# EAGLE design Puzzle I2C Motor Driver v0.92 (EAGLE 6.2)
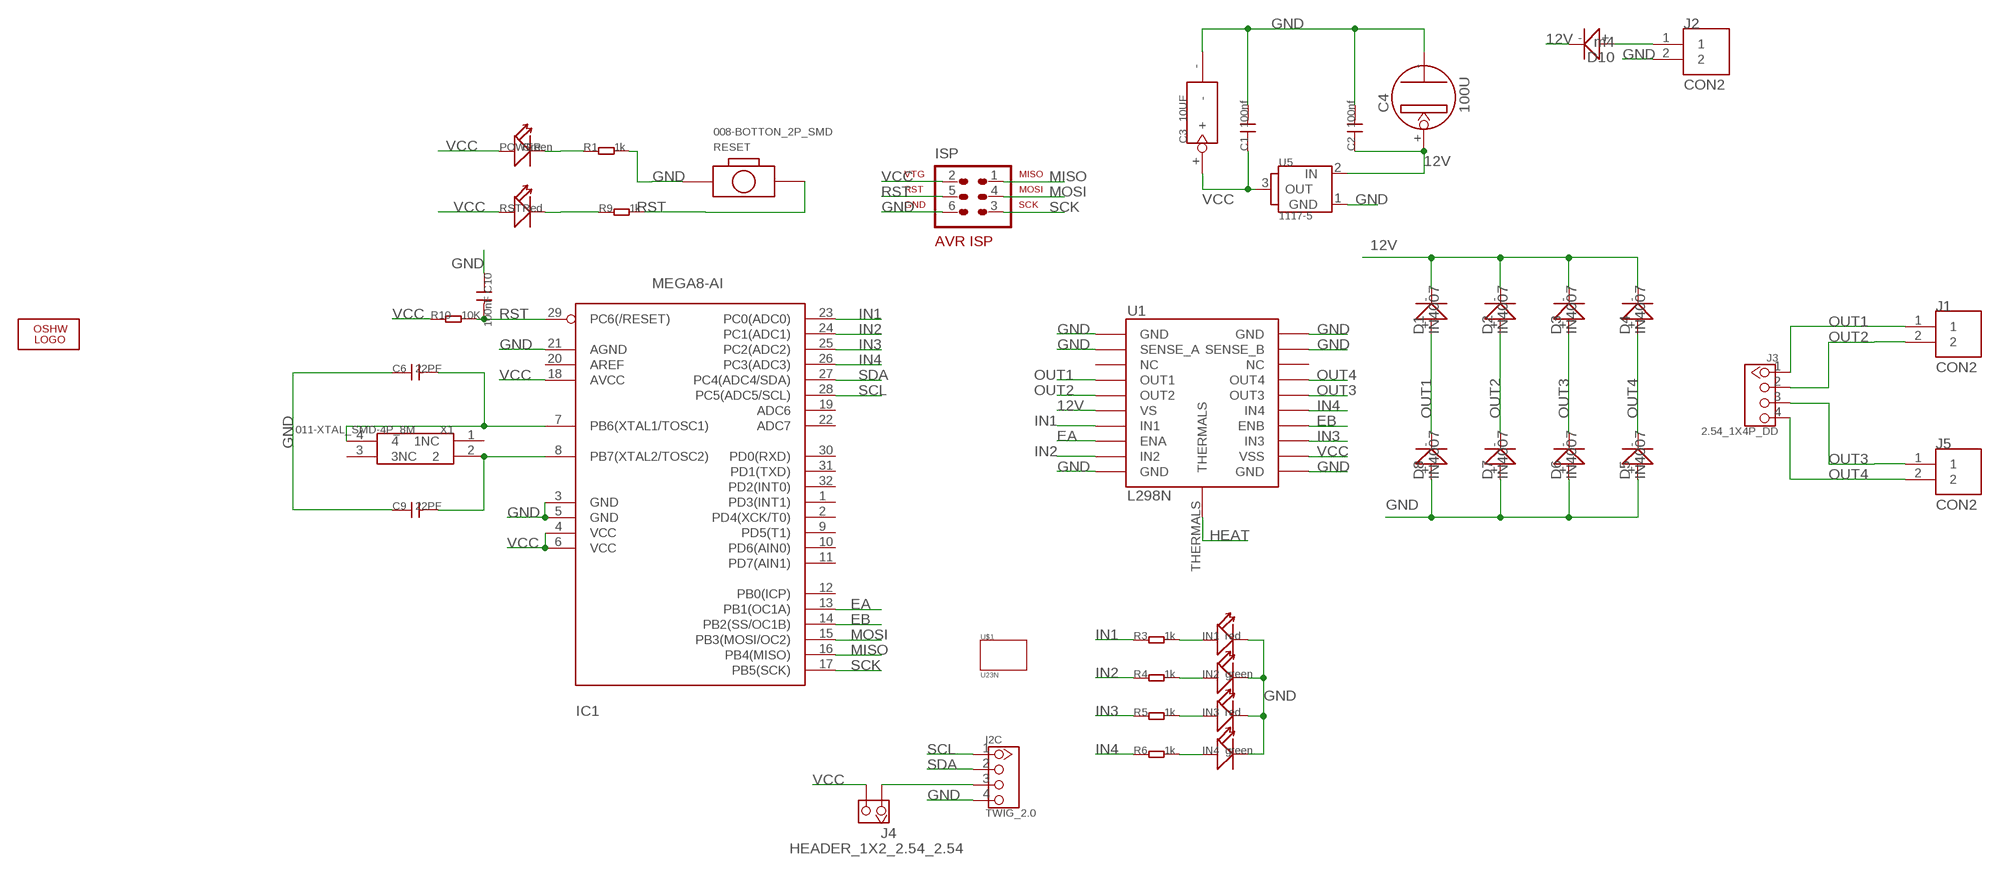
[diagram p0: schematic, sheet 1]

## Parts
C1  100nf  006-C30*35  [0603_S]
C2  100nf  006-C30*35  [0603_S]
C3  10UF  C_TAN_B  [C_TAN_3X3.5]
C4  100U  PANASONIC_D260  [SANYO-OSCON_SMD_C6]
C6  22PF  006-C30*35  [0603_S]
C9  22PF  006-C30*35  [0603_S]
C10  100nF  006-C30*35  [0603_S]
D1  IN4007  010-D2010  [D2010]
D2  IN4007  010-D2010  [D2010]
D3  IN4007  010-D2010  [D2010]
D4  IN4007  010-D2010  [D2010]
D5  IN4007  010-D2010  [D2010]
D6  IN4007  010-D2010  [D2010]
D7  IN4007  010-D2010  [D2010]
D8  IN4007  010-D2010  [D2010]
D10  m4  010-D2010  [D2010]
I2C  TWIG_2.0  [2.0_1X4]
IC1  MEGA8-AI  [TQFP32-08]
IN1  red  007-LED0603  [D0603]
IN2  green  007-LED0603  [D0603]
IN3  red  007-LED0603  [D0603]
IN4  green  007-LED0603  [D0603]
ISP  AVR-ISP-6  [AVR-ISP-6]
J1  CON2  [CON2]
J2  CON2  [CON2]
J3  2.54_1X4P_DD  [CK_1X4]
J4  HEADER_1X2_2.54_2.54  [65*35]
J5  CON2  [CON2]
LOGO2  LOGO-OSHW-FILLX0200-NT  [OSHW_FILLX200_NOTEXT]
POWER  Green  007-LED0603  [D0603]
R1  1k  005-R0603  [0603-1]
R3  1k  005-R0603  [0603-1]
R4  1k  005-R0603  [0603-1]
R5  1k  005-R0603  [0603-1]
R6  1k  005-R0603  [0603-1]
R9  1k  005-R0603  [0603-1]
R10  10K  005-R0603  [0603-1]
RESET  008-BOTTON_2P_SMD  [BOTTON_1]
RST  Red  007-LED0603  [D0603]
U1  L298N  L298_BRIDGE_DRIVER  [POWERSO20]
U5  1117-5  [TO252]
U$1  U23N  [U2*3N]
X1  011-XTAL_SMD-4P_8M  011-XTAL_SMD-4P  [CRYSTAL-SMD-5X3]

## Nets
12V: C2.1 C4.+ D1.- D2.- D3.- D4.- D10.- U1.P$6(VS) U5.2(IN)
EA: IC1.13(PB1(OC1A)) U1.P$8(ENA)
EB: IC1.14(PB2(SS/OC1B)) U1.P$14(ENB)
GND: C1.2 C2.2 C3.- C4.- C6.1 C9.1 C10.1 D5.+ D6.+ D7.+ D8.+ I2C.4 IC1.3(GND) IC1.5(GND) IC1.21(AGND) IN1.- IN2.- IN3.- IN4.- ISP.6 J2.2 R1.2 RESET.1 U1.P$1(GND) U1.P$2(SENSE_A) U1.P$10(GND) U1.P$11(GND) U1.P$19(SENSE_B) U1.P$20(GND) U5.1(GND)
HEAT: U1.THERMALS
IN1: IC1.23(PC0(ADC0)) R3.1 U1.P$7(IN1)
IN2: IC1.24(PC1(ADC1)) R4.1 U1.P$9(IN2)
IN3: IC1.25(PC2(ADC2)) R5.1 U1.P$13(IN3)
IN4: IC1.26(PC3(ADC3)) R6.1 U1.P$15(IN4)
MISO: IC1.16(PB4(MISO)) ISP.1
MOSI: IC1.15(PB3(MOSI/OC2)) ISP.4
N$1: IN3.+ R5.2
N$2: I2C.3 J4.1
N$3: POWER.- R1.1
N$6: D10.+ J2.1
N$8: C6.2 IC1.7(PB6(XTAL1/TOSC1)) X1.4
N$9: C9.2 IC1.8(PB7(XTAL2/TOSC2)) X1.2
N$10: R9.1 RST.-
N$14: IN1.+ R3.2
N$15: IN2.+ R4.2
N$17: IN4.+ R6.2
OUT1: D1.+ D8.- J1.1 J3.1 U1.P$4(OUT1)
OUT2: D2.+ D7.- J1.2 J3.2 U1.P$5(OUT2)
OUT3: D3.+ D6.- J3.3 J5.1 U1.P$16(OUT3)
OUT4: D4.+ D5.- J3.4 J5.2 U1.P$17(OUT4)
RST: C10.2 IC1.29(PC6(/RESET)) ISP.5 R9.2 R10.2 RESET.P$2
SCK: IC1.17(PB5(SCK)) ISP.3
SCL: I2C.1 IC1.28(PC5(ADC5/SCL))
SDA: I2C.2 IC1.27(PC4(ADC4/SDA))
VCC: C1.1 C3.+ IC1.4(VCC) IC1.6(VCC) IC1.18(AVCC) ISP.2 J4.2 POWER.+ R10.1 RST.+ U1.P$12(VSS) U5.3(OUT)
Unconnected: IC1.1(PD3(INT1)) IC1.2(PD4(XCK/T0)) IC1.9(PD5(T1)) IC1.10(PD6(AIN0)) IC1.11(PD7(AIN1)) IC1.12(PB0(ICP)) IC1.19(ADC6) IC1.20(AREF) IC1.22(ADC7) IC1.30(PD0(RXD)) IC1.31(PD1(TXD)) IC1.32(PD2(INT0)) U1.P$3(NC) U1.P$18(NC) X1.1(1NC) X1.3(3NC)

## Library data of the parts
C1 C2 C6 C9 C10 = Discrete:006-C*: Ceramic Capacitors
C3 = CPT_SMD:C_TAN
C4 = CPT_SMD:PANASONIC_D
D1-D8 D10 = Discrete:010-D*
I2C = CONNECTER:TWIG_2.0
IC1 = IC:MEGA8: MICROCONTROLLER 8 Kbytes FLASH 1 kbytes SRAM 512 bytes EEPROM USART 6-channel 10 bit ADC 2-channel 8 bit ADC
IN1-IN4 POWER RST = Discrete:007-LED*
ISP = AVR_Micro_Controllers:AVR-ISP-6: AVR ISP-6 Serial Programming Header
J1 J2 J5 = 2pin:CON2
J3 = Connector:2.54_1X4P
J4 = Connector:HEADER_1X2_2.54
LOGO2 = Logo:LOGO-OSHW-FILL
R1 R3-R6 R9 R10 = Discrete:005-R*
RESET = Discrete:008-BOTTON_2P
U1 = ICs:L298_BRIDGE_DRIVER
U5 = ICs_v54:1117-5
U$1 = twig_template1:U2*3N
X1 = Discrete:011-XTAL_SMD-4P

## Board
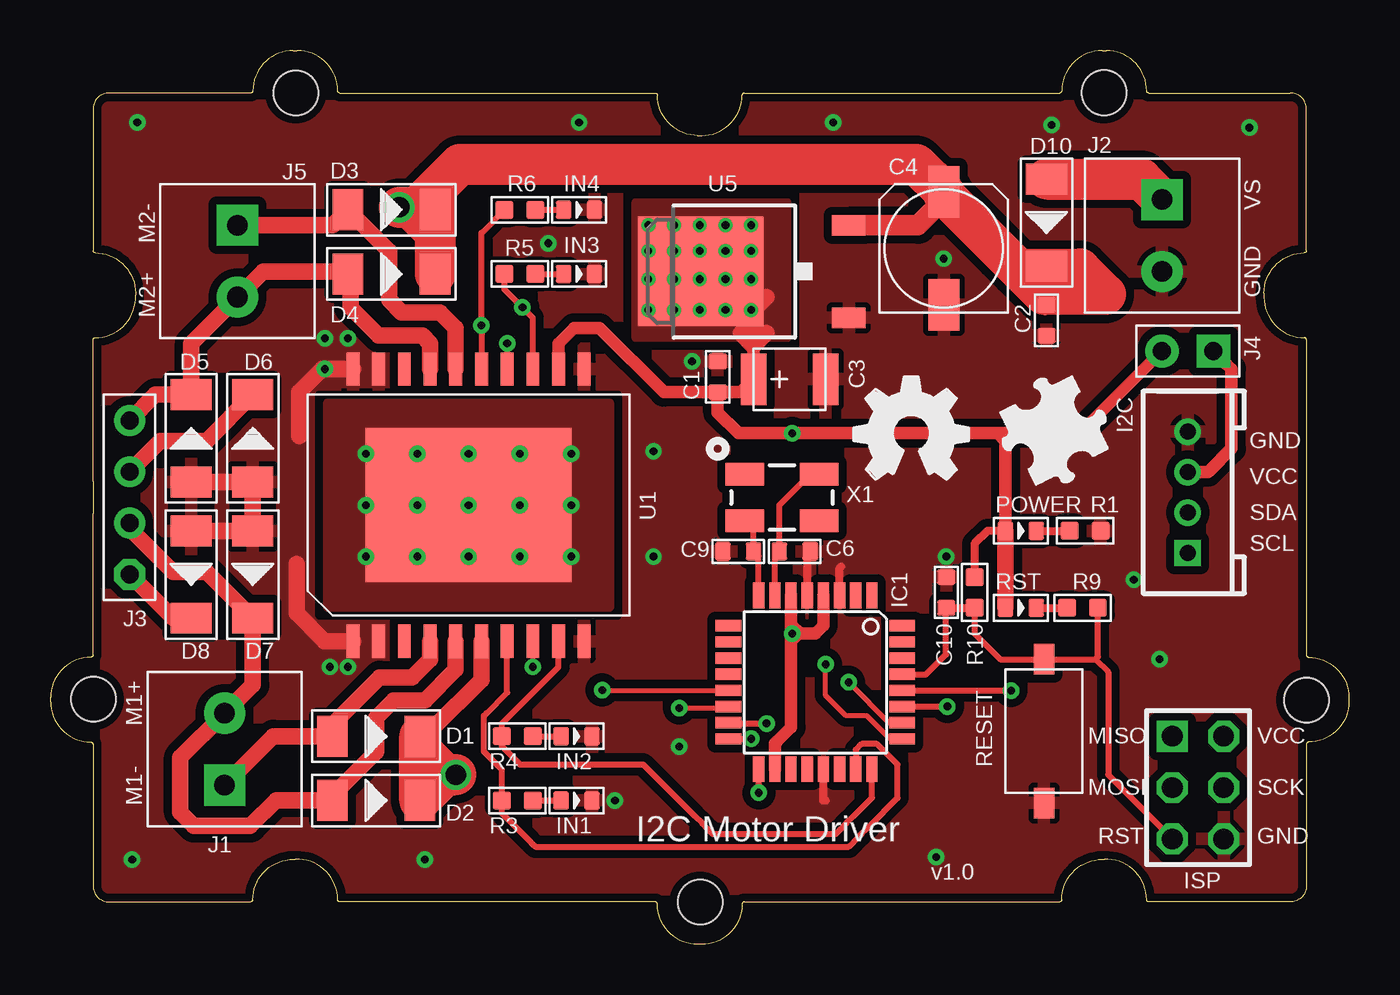
[diagram p1: board, top side]
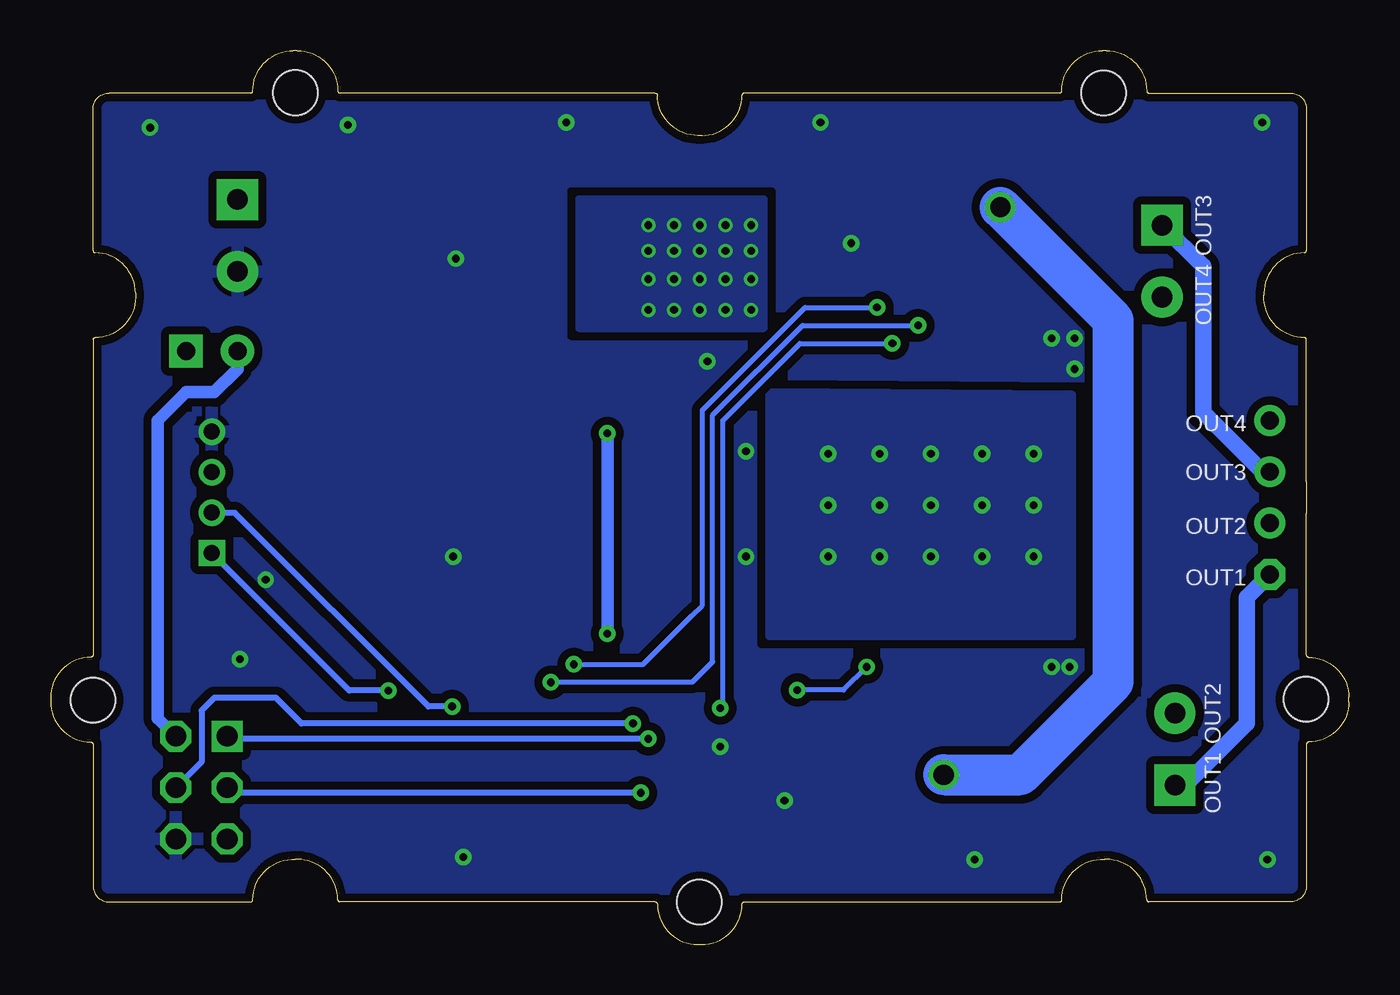
[diagram p2: board, bottom side, seen from below]

Size 64.2 x 44.2 mm. Coordinates in mm from the lower left corner, seen from the top.
Copper layers (1*16): Top 0.035mm / dielectric 1.5mm / Bottom 0.035mm
Design rules: minimum track width 6mil, minimum drill 12mil, track to track 6mil, track to pad 6mil, pad to pad 6mil, via to via 6mil, smd to smd 0mil, copper to edge 10mil, drill to drill 10mil, minimum pad ring 10mil, minimum via ring 6mil, stop-mask expansion 2mil, vias tented up to drill 100mil, thermal gap 10mil

### Footprints (pad centres in the part's own frame; a part is rotated, then mirrored left to right if it is on the bottom)
0603_S = smd 0.762 x 0.889: 1 -0.762,0; 2 0.762,0
C_TAN_3X3.5 = smd 2.54 x 1.27: + 0,1.778; - 0,-1.778
SANYO-OSCON_SMD_C6 = smd 2.54 x 1.524: + 2.794,0; - -2.794,0
D2010 = smd 1.524 x 2.032: + -2.159,0; - 2.159,0
2.0_1X4 = drill 0.8 pad 1.27 square: 1 -3,0 | drill 0.8 pad 1.27: 2 -1,0; 3 1,0; 4 3,0
TQFP32-08 = smd 1.27 x 0.559: 1 -4.293,2.8; 2 -4.293,2; 3 -4.293,1.2; 4 -4.293,0.4; 5 -4.293,-0.4; 6 -4.293,-1.2; 7 -4.293,-2; 8 -4.293,-2.8; 17 4.293,-2.8; 18 4.293,-2; 19 4.293,-1.2; 20 4.293,-0.4; 21 4.293,0.4; 22 4.293,1.2; 23 4.293,2; 24 4.293,2.8 | smd 0.559 x 1.27: 9 -2.8,-4.293; 10 -2,-4.293; 11 -1.2,-4.293; 12 -0.4,-4.293; 13 0.4,-4.293; 14 1.2,-4.293; 15 2,-4.293; 16 2.8,-4.293; 25 2.8,4.293; 26 2,4.293; 27 1.2,4.293; 28 0.4,4.293; 29 -0.4,4.293; 30 -1.2,4.293; 31 -2,4.293; 32 -2.8,4.293
D0603 = smd 0.762 x 0.889: + -0.762,0; - 0.762,0
AVR-ISP-6 = drill 1.016 square: 1 -2.54,-1.27 | drill 1.016 octagon: 2 -2.54,1.27; 3 0,-1.27; 4 0,1.27; 5 2.54,-1.27; 6 2.54,1.27
CON2 = drill 1.016 pad 2.032 square: 1 0,1.778 | drill 1.016 pad 2.032: 2 0,-1.778
CK_1X4 = drill 0.889 pad 1.524 octagon: 1 0,3.81 | drill 0.889 pad 1.524: 2 0,1.27; 3 0,-1.27; 4 0,-3.81
65*35 = drill 0.889 pad 1.651 square: 1 0,1.27 | drill 0.889 pad 1.651: 2 0,-1.27
0603-1 = smd 0.889 x 0.889: 1 -0.762,0; 2 0.762,0
BOTTON_1 = smd 1.524 x 1.016: 1 -3.556,0; P$2 3.556,0
POWERSO20 = smd 1.651 x 0.635: P$1 -6.731,5.715; P$2 -6.731,4.445; P$3 -6.731,3.175; P$4 -6.731,1.905; P$5 -6.731,0.635; P$6 -6.731,-0.635; P$7 -6.731,-1.905; P$8 -6.731,-3.175; P$9 -6.731,-4.445; P$10 -6.731,-5.715; P$11 6.731,-5.715; P$12 6.731,-4.445; P$13 6.731,-3.175; P$14 6.731,-1.905; P$15 6.731,-0.635; P$16 6.731,0.635; P$17 6.731,1.905; P$18 6.731,3.175; P$19 6.731,4.445; P$20 6.731,5.715 | smd 7.62 x 10.16: THERMALS 0,0
TO252 = smd 1.016 x 1.651: 1 -2.286,-4.826; 2 2.286,-4.826 | smd 5.4 x 6.2: 3 0,2.5
U2*3N = hole 2.2: -0.017,20.015; -30.005,10.02; 29.985,9.983; 19.98,-20.005; -19.983,-20.015
CRYSTAL-SMD-5X3 = smd 1.9 x 1.1: 1 -1.85,1.15; 2 -1.85,-1.15; 3 1.85,-1.15; 4 1.85,1.15

### Placement (x,y rotation side)
C1  32.99,28.07 90 top
C2  49.25,30.86 270 top
C3  36.55,27.94 90 top
C4  44.17,34.42 90 top
C6  36.8,19.43 180 top
C9  34.01,19.43 0 top
C10  44.29,17.4 270 top
D1  16.1,10.29 0 top
D2  16.1,7.11 0 top
D3  16.86,36.32 0 top
D4  16.86,33.15 0 top
D5  6.95,25.02 90 top
D6  10,25.02 90 top
D7  10,18.29 270 top
D8  6.95,18.29 270 top
D10  49.25,35.69 270 top
I2C  56.23,22.35 90 top
IC1  37.82,12.96 270 top
IN1  26,7.11 0 top
IN2  26,10.29 0 top
IN3  26.13,33.15 0 top
IN4  26.13,36.32 0 top
ISP  56.74,7.75 270 top
J1  8.61,9.65 180 top
J2  54.96,35.05 0 top
J3  3.91,22.1 180 top
J4  56.23,29.34 270 top
J5  9.24,33.78 0 top
LOGO2  39.72,22.99 0 top
POWER  47.98,20.45 0 top
R1  51.15,20.45 0 top
R3  23.08,7.11 0 top
R4  23.08,10.29 0 top
R5  23.21,33.15 0 top
R6  23.21,36.32 0 top
R9  51.02,16.64 0 top
R10  45.69,17.4 270 top
RESET  49.12,10.54 90 top
RST  47.98,16.64 0 top
U1  20.67,21.72 90 top
U5  34.64,33.28 90 top
U$1  32.1,22.1 180 top
U$3  [BRICK-LOGO-MIL-0.6]  46.58,22.35 0 top
X1  36.16,22.1 0 top

### Tracks (layer width: path | path; a pad name or v marks a point on that pad's centre or on a via)
12V  (via drill 1 pad 1.27)
  Top 0.813: U1.P$6 21.31,13.08 18.89,10.67 18.64,10.67 D1.-
  Top 1.016: D10.- 49.25,32.13 C2.1 | U5.2 42.9,35.56 44.29,36.96
  Top 2.032: D3.- D4.- | D3.- 19.02,37.35 20.25,38.58 42.8,38.58 C4.+ 44.17,37.09 44.29,36.96 47.09,34.17 47.85,33.4 | 17.75,36.45 18.89,36.45 D3.- | D2.- 18.26,8.51 | 18.26,8.51 D1.- | 18.26,8.51 18.38,8.38 v20.04,8.38 19.53,8.38 | 17.75,36.45 v17.24,36.45 18.13,36.45 19.27,37.59 | 17.75,36.45 18.89,35.31 | 19.53,8.38 18.38,9.53 | 19.53,8.38 18.51,7.37 | 47.85,33.4 49.12,32.13 49.25,32.13 52.17,32.13 50.9,33.4 47.85,33.4
  Bottom 2.032: v20.04,8.38 16.26,8.38 11.65,12.99 11.65,30.86 v17.24,36.45
EA  (via drill 0.38 pad 0.81)
  Top 0.254: 27.29,12.56 IC1.13 | U1.P$8 v23.85,13.72
  Top 0.305: v27.27,12.58 27.29,12.56
  Bottom 0.254: v27.27,12.58 24.99,12.58 v23.85,13.72
EB  (via drill 0.38 pad 0.81)
  Top 0.254: v31.08,11.69 33.45,11.69
  Top 0.305: v22.58,29.72 U1.P$14 | 33.45,11.69 IC1.14
  Bottom 0.254: v22.58,29.72 27.15,29.72 30.96,25.91 30.96,11.81 v31.08,11.69
GND  (via drill 0.38 pad 0.81)
  Top 0.406: IC1.21 38.22,7.22 38.32,7.11 38.2,7.11 | IC1.3 39.02,18.6 39.09,18.67 | IC1.5 37.42,19.29 C6.1
  Top 0.813: U1.P$20 v13.56,28.45 13.43,28.45 12.29,27.31 12.29,25.15 | U1.P$1 13.56,14.99 12.16,16.39 12.16,18.8 | D5.+ D6.+ 10,20.96 D7.+ D8.+
  other vias: 24.61,34.67 29.81,19.18 29.81,24.39 44.17,33.91 31.72,28.83 38.7,40.64 54.83,14.1 43.78,4.32 53.56,18.04 13.81,13.72 49.5,40.52 13.56,29.97 14.7,29.97 14.7,13.72 27.91,7.11 31.08,9.78 59.28,40.39 18.51,4.19 4.03,4.19 26.13,40.64 4.29,40.64 44.29,19.18
  pour Top (isolate 0.406, rank 6): -0.92,45.85 65.76,45.98 65.76,-0.38 -0.92,-0.51
  pour Bottom (isolate 0.406, rank 6): -0.92,45.85 65.76,45.85 65.76,-0.51 -0.92,-0.51
  pour Top (isolate 0.406, rank 2, no thermals): 13.69,29.85 16.86,29.85 16.86,27.69 13.69,27.69
  pour Top (isolate 0.406, rank 2, no thermals): 12.92,15.88 16.86,15.88 16.86,12.83 12.92,12.83
  pour Top (isolate 0.406, rank 2, no thermals): 12.92,30.61 16.86,30.61 16.86,27.69 12.92,27.69
HEAT  (via drill 0.38 pad 0.81)
  other vias: 20.67,21.72 23.21,21.72 18.13,21.72 23.21,24.26 20.67,24.26 18.13,24.26 18.13,19.18 20.67,19.18 23.21,19.18 25.75,24.26 25.75,21.72 25.75,19.18 15.59,19.18 15.59,21.72 15.59,24.26
  pour Top (isolate 0.406, no thermals): 13.69,26.8 27.66,26.8 27.66,16.64 13.69,16.64
  pour Bottom (isolate 0.406, no thermals): 13.69,27.18 28.67,27.31 28.67,15.24 13.69,15.24
IN1
  Top 0.305: U1.P$7 22.58,12.45 21.56,11.43 21.43,11.31 21.43,9.53 22.32,8.64 R3.1 22.32,6.48 22.96,5.84 23.08,5.72 23.46,5.34 23.72,5.08 23.85,4.96 23.97,4.83 39.47,4.83 39.97,5.34 40.1,5.46 40.36,5.72 40.48,5.84 41.88,7.24 41.88,8.89 40.86,9.91 40.1,9.91 39.82,9.62 IC1.23
IN2
  Top 0.305: U1.P$9 25.12,13.72 22.32,10.92 R4.1 22.32,9.78 23.21,8.89 29.31,8.89 31.85,6.35 32.23,5.97 32.48,5.72 32.73,5.46 38.83,5.46 39.09,5.72 39.34,5.97 39.72,6.35 40.36,6.99 40.62,7.25 IC1.24
IN3  (via drill 0.38 pad 0.81)
  Top 0.254: IC1.25 41.5,10.16 40.36,11.31 39.34,11.31 38.32,12.32 v38.32,13.85 | v23.34,31.5 23.78,31.05
  Top 0.305: U1.P$13 23.85,30.99 23.78,31.05 v23.34,31.5 22.45,32.39 R5.1
  Bottom 0.254: v38.32,13.85 34.89,13.85 32.48,16.26 31.97,16.77 31.97,26.42 27.15,31.24 26.89,31.5 v23.34,31.5
IN4  (via drill 0.38 pad 0.81)
  Top 0.254: IC1.26 41.47,10.96 v39.47,12.96
  Top 0.305: v21.31,30.61 U1.P$15 | v21.31,30.61 21.31,31.12 | 21.31,31.12 21.31,35.18 R6.1 | v21.31,30.61 21.31,31.12
  Bottom 0.254: v39.47,12.96 32.48,12.96 31.47,13.97 31.47,26.16 27.02,30.61 v21.31,30.61
MISO  (via drill 0.38 pad 0.81)
  Top 0.305: IC1.16 v34.63,10.16 v34.64,10.16
  Bottom 0.305: v34.64,10.16 53.56,10.16 55.34,10.16 ISP.1
MOSI  (via drill 0.38 pad 0.81)
  Top 0.305: v35.4,10.92 33.55,10.92 IC1.15
  Bottom 0.305: v35.4,10.92 51.79,10.92 53.05,12.19 56.1,12.19 56.74,11.56 56.74,9.02 ISP.4
N$1
  Top 0.305: R5.2 IN3.+
N$2
  Top 0.61: J4.1 58.14,28.7 58.39,28.45 58.39,24.51 57.31,23.43 | 57.31,23.43 57.25,23.37 | I2C.3 57.23,23.35 57.31,23.43
N$3
  Top 0.406: POWER.- R1.1
N$6
  Top 2.032: D10.+ 53.94,37.85 J2.1
N$8
  Top 0.305: IC1.7 35.82,19.21 C6.2 36.04,21.72 37.56,23.24 X1.4
N$9
  Top 0.305: IC1.8 35.02,19.19 C9.2 34.77,20.5 X1.2
N$10
  Top 0.406: RST.- R9.1
N$14
  Top 0.305: R3.2 IN1.+
N$15
  Top 0.305: R4.2 IN2.+
N$17
  Top 0.305: R6.2 IN4.+
OUT1
  Top 0.813: U1.P$4 18.77,14.1 17.88,13.21 16.28,13.21 13.94,10.87 D1.+ 11.02,10.29 J1.1 | D8.- 6.07,16.13 J3.1
  Bottom 0.813: J1.1 8.1,7.88 5.05,10.92 5.05,17.15 J3.1
OUT2
  Top 0.813: U1.P$5 20.04,13.59 18.51,12.07 16.96,12.07 16.1,11.2 16.1,9.53 14.19,7.62 14.19,7.37 D2.+ 11.15,7.11 9.88,5.85 7.08,5.85 7.08,5.87 6.41,6.53 6.41,9.24 J1.2 10,12.83 D7.- 7.72,18.42 6.07,18.42 3.91,20.58 J3.2
OUT3
  Top 0.813: U1.P$16 20.04,30.48 19.27,31.24 17.37,31.24 16.73,31.88 16.73,34.29 D3.+ 13.94,35.56 J5.1 | D6.- 7.72,24.89 5.81,24.89 5.43,24.89 J3.3
  Bottom 0.813: 9.11,35.56 J5.1 7.21,33.53 7.21,26.29 4.29,23.37 J3.3
OUT4
  Top 0.813: U1.P$17 18.77,29.72 18.38,30.1 16.23,30.1 14.83,31.5 14.83,33.02 D4.+ 14.57,33.28 10.51,33.28 J5.2 6.95,29.72 D5.- 5.18,27.18 J3.4
RST
  Top 0.305: 44.27,16.66 44.27,14.33 43.28,13.34 42.13,13.34 IC1.29 | R10.2 45.69,15.37 46.96,14.1 RESET.P$2 51.66,14.1 | ISP.5 52.29,8.38 52.29,13.46 51.66,14.1 | R9.2 51.79,14.23 51.66,14.1
  Top 0.406: 44.27,16.66 C10.2 R10.2
SCK  (via drill 0.38 pad 0.81)
  Top 0.305: v35.02,7.5 35.02,7.88 IC1.17
  Bottom 0.305: v35.02,7.5 55.21,7.5 ISP.3
SCL  (via drill 0.38 pad 0.81)
  Top 0.305: IC1.28 v47.49,12.56 v47.49,12.55
  Bottom 0.305: v47.49,12.55 49.43,12.55 I2C.1
SDA  (via drill 0.38 pad 0.81)
  Top 0.305: IC1.27 v44.34,11.76
  Bottom 0.305: v44.34,11.76 45.51,11.76 55.09,21.34 56.21,21.34 I2C.2
VCC  (via drill 0.38, 0.38 pad 0.81)
  Top 0.406: R10.1 45.69,19.43 45.69,19.81 46.32,20.45 POWER.+
  Top 0.61: 36.62,14.99 36.62,10.74 35.91,10.04 35.82,9.94 IC1.18 | IC1.4 38.22,15.77 37.82,15.37 37.05,15.37 | 37.05,15.37 36.67,15.75 37.05,15.37 | 37.05,15.37 37,15.37 36.62,14.99 | U1.P$12 25.12,29.72 25.88,30.48 27.15,30.48 30.32,27.31 C1.1 | 34.77,29.59 C3.+ 34.13,27.31 C1.1 | C1.1 32.99,26.29 34.01,25.28 v36.67,25.28 | v36.67,25.28 37.43,25.28 | 37.43,25.28 39.47,25.28 40.48,25.28 46.83,25.28 | 46.83,25.28 47.59,25.28 | 47.59,25.28 47.72,25.28 | 47.72,25.28 50.9,25.28 J4.2 | 47.21,24.77 POWER.+ | 47.21,24.89 47.21,24.77 | 46.83,25.28 47.21,24.89 | 36.62,14.99 36.62,15.31 v36.67,15.37 36.62,15.43 IC1.6 | v36.67,25.28 37.43,25.28 | 47.21,24.89 47.21,24.77 | 47.59,25.28 47.21,24.89 | 47.59,25.28 47.72,25.28
  Top 0.813: POWER.+ RST.+ | 34.77,31.37 34.01,32.13 | 34.77,29.59 34.77,31.37 | 34.77,31.37 35.4,32.01 | 34.77,29.59 34.13,30.23 35.4,30.23 34.77,29.59
  Bottom 0.61: v36.67,15.37 v36.67,25.28 | ISP.2 58.9,11.18 58.9,25.91 57.5,27.31 56.1,27.31 54.96,28.45 J4.2
  other vias: 30.83,35.56 32.1,35.56 33.37,35.56 29.56,34.29 30.83,34.29 32.1,34.29 33.37,34.29 29.56,32.89 30.83,32.89 32.1,32.89 33.37,32.89 34.64,32.89 33.37,31.37 32.1,31.37 30.83,31.37 29.56,31.37 34.64,34.29 29.56,35.56 34.64,35.56 34.64,31.37
  pour Bottom (isolate 0.152): 28.93,36.83 38.07,36.83 38.07,30.48 28.93,30.48
  pour Top (isolate 0.152, no thermals): 28.93,36.7 36.42,36.7 36.42,29.97 28.93,29.97

### Text on the board
tPlace: VS | M2- | GND | M2+ | GND | VCC | SDA | SCL | M1+ | MISO | VCC | M1- | MOSI | SCK | I2C Motor Driver | RST | GND | v1.0
bPlace: OUT3 | OUT4 | OUT4 | OUT3 | OUT2 | OUT1 | OUT2 | OUT1